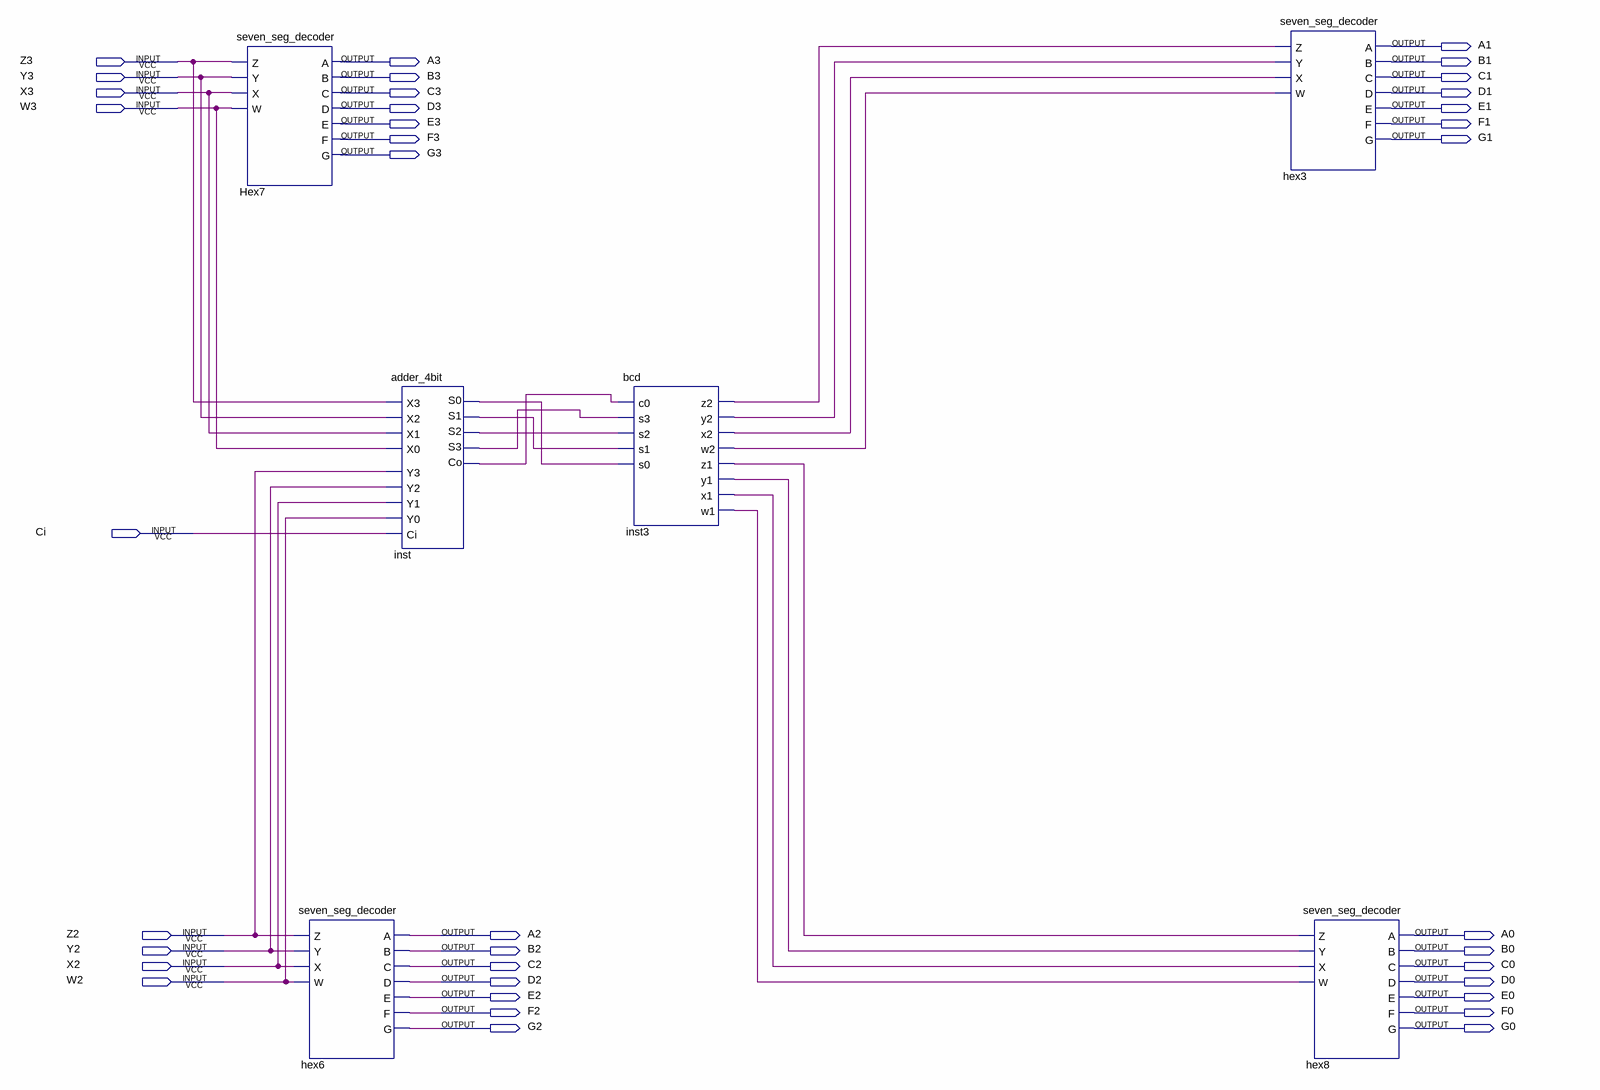
[diagram p0: schematic sheet]
// Quartus schematic lab6step0.bdf as structural Verilog: 6 symbols, 37 pins
module lab6step0 (
  input  Z3,
  input  Y3,
  input  X3,
  input  W3,
  input  Ci,
  input  Z2,
  input  Y2,
  input  X2,
  input  W2,
  output A1,
  output A3,
  output B1,
  output B3,
  output C1,
  output C3,
  output D1,
  output D3,
  output E1,
  output E3,
  output F1,
  output F3,
  output G1,
  output G3,
  output A2,
  output A0,
  output B2,
  output B0,
  output C2,
  output C0,
  output D2,
  output D0,
  output E2,
  output E0,
  output F2,
  output F0,
  output G2,
  output G0
);

  wire inst3_w1, inst3_w2, inst3_x1, inst3_x2, inst3_y1, inst3_y2, inst3_z1, inst3_z2, inst_co, inst_s0,
       inst_s1, inst_s2, inst_s3;

  seven_seg_decoder Hex7 (.Z(Z3), .Y(Y3), .X(X3), .W(W3), .A(A3), .B(B3), .C(C3), .D(D3), .E(E3), .F(F3), .G(G3));
  seven_seg_decoder hex6 (.Z(Z2), .Y(Y2), .X(X2), .W(W2), .A(A2), .B(B2), .C(C2), .D(D2), .E(E2), .F(F2), .G(G2));
  adder_4bit inst (
    .X3(Z3), .Y3(Z2), .X2(Y3), .Y2(Y2), .X1(X3), .Y1(X2), .X0(W3), .Y0(W2), .Ci(Ci), .S0(inst_s0),
    .S1(inst_s1), .S2(inst_s2), .S3(inst_s3), .Co(inst_co));
  bcd inst3 (
    .c0(inst_co), .s3(inst_s3), .s2(inst_s2), .s1(inst_s1), .s0(inst_s0), .z2(inst3_z2), .y2(inst3_y2),
    .x2(inst3_x2), .w2(inst3_w2), .z1(inst3_z1), .y1(inst3_y1), .x1(inst3_x1), .w1(inst3_w1));
  seven_seg_decoder hex3 (
    .Z(inst3_z2), .Y(inst3_y2), .X(inst3_x2), .W(inst3_w2), .A(A1), .B(B1), .C(C1), .D(D1), .E(E1), .F(F1),
    .G(G1));
  seven_seg_decoder hex8 (
    .Z(inst3_z1), .Y(inst3_y1), .X(inst3_x1), .W(inst3_w1), .A(A0), .B(B0), .C(C0), .D(D0), .E(E0), .F(F0),
    .G(G0));
endmodule
